# EAGLE schematic example_schematic_5V (EAGLE 6.5.0)
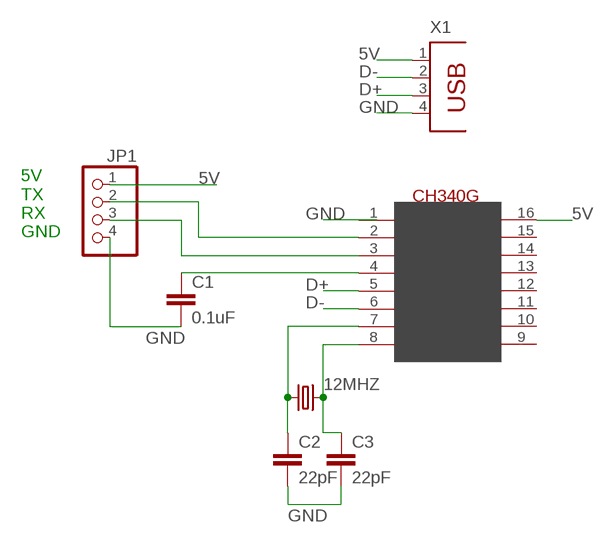
[diagram p0: schematic, sheet 1]

## Parts
12MHZ  CRYSTALHC18U-V  [HC18U-V]
C1  0.1uF  C2.5/2  [C2.5-2]
C2  22pF  C2.5/2  [C2.5-2]
C3  22pF  C2.5/2  [C2.5-2]
JP1  PINHD-1X4  [1X04]
U$1  CH340G  [SOIC16]
X1  PN61729  [PN61729]

## Nets
5V: JP1.1 U$1.16(VCC) X1.1
D+: U$1.5(D+) X1.3
D-: U$1.6(D-) X1.2
GND: C1.2 C2.2 C3.2 JP1.4 X1.4
N$1: 12MHZ.1 C2.1 U$1.7(XI)
N$2: 12MHZ.2 C3.1 U$1.8(XO)
N$3: C1.1 U$1.4(V3)
N$4: JP1.3 U$1.3(RX)
N$5: JP1.2 U$1.2(TX)
Unconnected: U$1.1(GND) U$1.9(CTS) U$1.10(DSR) U$1.11(RI) U$1.12(DCD) U$1.13(DTR) U$1.14(RTS) U$1.15(RS232)

## Notes on the sheet
- 5V
  TX
  RX
  GND

## Library data of the parts
12MHZ = crystal:CRYSTAL: CRYSTAL; OC_FARNELL: unknown; OC_NEWARK: unknown
C1-C3 = capacitor-wima:C: CAPACITOR naming: grid - package width
JP1 = pinhead:PINHD-1X4: PIN HEADER
U$1 = usb-serial:CH340G
X1 = con-berg:PN61729: BERG USB connector; OC_FARNELL: unknown; OC_NEWARK: unknown